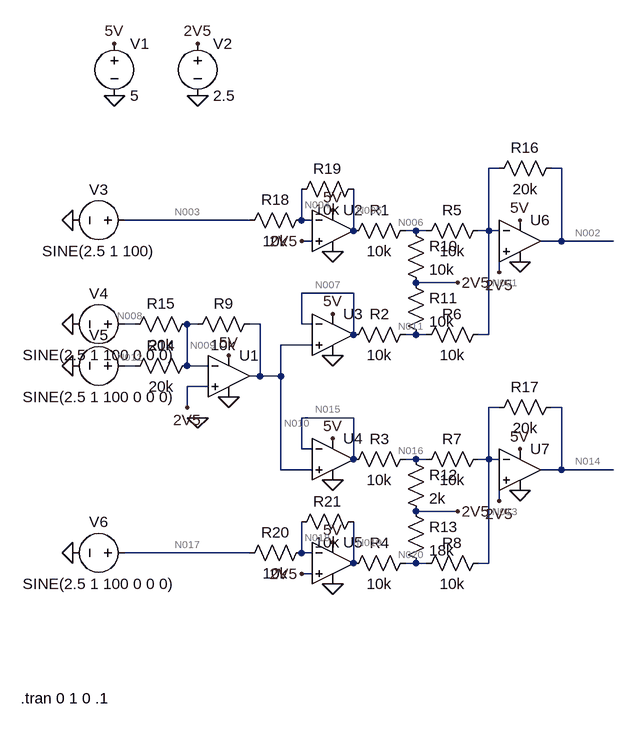
[diagram p0: schematic crossfader.asc]
crossfader.asc, the LTspice schematic file:
Version 4
SHEET 1 1012 832
WIRE 832 0 816 0
WIRE 928 0 912 0
WIRE 448 80 256 80
WIRE 528 80 528 32
WIRE 544 80 528 80
WIRE 608 96 608 32
WIRE 704 96 688 96
WIRE 720 96 704 96
WIRE 816 96 816 0
WIRE 816 96 800 96
WIRE 832 96 816 96
WIRE 544 112 528 112
WIRE 928 112 928 0
WIRE 928 112 896 112
WIRE 1008 112 928 112
WIRE 832 160 832 128
WIRE 768 176 704 176
WIRE 608 192 528 192
WIRE 272 240 256 240
WIRE 368 240 352 240
WIRE 464 240 448 240
WIRE 528 240 528 192
WIRE 544 240 528 240
WIRE 608 256 608 192
WIRE 704 256 688 256
WIRE 720 256 704 256
WIRE 816 256 816 96
WIRE 816 256 800 256
WIRE 544 272 496 272
WIRE 272 304 256 304
WIRE 352 304 352 240
WIRE 384 304 352 304
WIRE 464 320 464 240
WIRE 464 320 448 320
WIRE 496 320 496 272
WIRE 496 320 464 320
WIRE 384 336 352 336
WIRE 352 368 352 336
WIRE 832 368 816 368
WIRE 928 368 912 368
WIRE 608 384 528 384
WIRE 528 432 528 384
WIRE 544 432 528 432
WIRE 608 448 608 384
WIRE 704 448 688 448
WIRE 720 448 704 448
WIRE 816 448 816 368
WIRE 816 448 800 448
WIRE 832 448 816 448
WIRE 496 464 496 320
WIRE 544 464 496 464
WIRE 928 464 928 368
WIRE 928 464 896 464
WIRE 1008 464 928 464
WIRE 832 512 832 480
WIRE 768 528 704 528
WIRE 448 592 256 592
WIRE 528 592 528 544
WIRE 544 592 528 592
WIRE 608 608 608 544
WIRE 704 608 688 608
WIRE 720 608 704 608
WIRE 816 608 816 448
WIRE 816 608 800 608
WIRE 544 624 528 624
FLAG 240 -112 0
FLAG 240 -192 5V
FLAG 416 288 5V
FLAG 416 352 0
FLAG 368 -112 0
FLAG 368 -192 2V5
FLAG 352 368 2V5
FLAG 576 64 5V
FLAG 576 128 0
FLAG 576 224 5V
FLAG 576 288 0
FLAG 576 416 5V
FLAG 576 480 0
FLAG 576 576 5V
FLAG 576 640 0
FLAG 864 80 5V
FLAG 864 144 0
FLAG 864 432 5V
FLAG 864 496 0
FLAG 832 160 2V5
FLAG 832 512 2V5
FLAG 768 176 2V5
FLAG 768 528 2V5
FLAG 176 80 0
FLAG 176 240 0
FLAG 176 304 0
FLAG 176 592 0
FLAG 368 384 0
FLAG 528 112 2V5
FLAG 528 624 2V5
SYMBOL OpAmps/UniversalOpAmp 416 320 R0
SYMATTR InstName U1
SYMBOL Voltage 240 -208 R0
SYMATTR InstName V1
SYMATTR Value 5
SYMBOL Voltage 368 -208 R0
SYMATTR InstName V2
SYMATTR Value 2.5
SYMBOL OpAmps/UniversalOpAmp 576 96 R0
SYMATTR InstName U2
SYMBOL OpAmps/UniversalOpAmp 576 256 R0
SYMATTR InstName U3
SYMBOL OpAmps/UniversalOpAmp 576 448 R0
SYMATTR InstName U4
SYMBOL OpAmps/UniversalOpAmp 576 608 R0
SYMATTR InstName U5
SYMBOL OpAmps/UniversalOpAmp 864 112 R0
SYMATTR InstName U6
SYMBOL OpAmps/UniversalOpAmp 864 464 R0
SYMATTR InstName U7
SYMBOL Res 704 80 R90
WINDOW 0 0 56 VBottom 2
WINDOW 3 32 56 VTop 2
SYMATTR InstName R1
SYMATTR Value 10k
SYMBOL Res 704 240 R90
WINDOW 0 0 56 VBottom 2
WINDOW 3 32 56 VTop 2
SYMATTR InstName R2
SYMATTR Value 10k
SYMBOL Res 704 432 R90
WINDOW 0 0 56 VBottom 2
WINDOW 3 32 56 VTop 2
SYMATTR InstName R3
SYMATTR Value 10k
SYMBOL Res 704 592 R90
WINDOW 0 0 56 VBottom 2
WINDOW 3 32 56 VTop 2
SYMATTR InstName R4
SYMATTR Value 10k
SYMBOL Res 816 80 R90
WINDOW 0 0 56 VBottom 2
WINDOW 3 32 56 VTop 2
SYMATTR InstName R5
SYMATTR Value 10k
SYMBOL Res 816 240 R90
WINDOW 0 0 56 VBottom 2
WINDOW 3 32 56 VTop 2
SYMATTR InstName R6
SYMATTR Value 10k
SYMBOL Res 816 432 R90
WINDOW 0 0 56 VBottom 2
WINDOW 3 32 56 VTop 2
SYMATTR InstName R7
SYMATTR Value 10k
SYMBOL Res 816 592 R90
WINDOW 0 0 56 VBottom 2
WINDOW 3 32 56 VTop 2
SYMATTR InstName R8
SYMATTR Value 10k
SYMBOL Res 464 224 R90
WINDOW 0 0 56 VBottom 2
WINDOW 3 32 56 VTop 2
SYMATTR InstName R9
SYMATTR Value 10k
SYMBOL Res 688 80 R0
SYMATTR InstName R10
SYMATTR Value 10k
SYMBOL Res 688 160 R0
SYMATTR InstName R11
SYMATTR Value 10k
SYMBOL Res 688 432 R0
SYMATTR InstName R12
SYMATTR Value 2k
SYMBOL Res 688 512 R0
SYMATTR InstName R13
SYMATTR Value 18k
SYMBOL Res 368 288 R90
WINDOW 0 0 56 VBottom 2
WINDOW 3 32 56 VTop 2
SYMATTR InstName R14
SYMATTR Value 20k
SYMBOL Res 368 224 R90
WINDOW 0 0 56 VBottom 2
WINDOW 3 32 56 VTop 2
SYMATTR InstName R15
SYMATTR Value 20k
SYMBOL Voltage 272 80 R90
WINDOW 0 -32 56 VBottom 2
WINDOW 3 32 56 VTop 2
SYMATTR InstName V3
SYMATTR Value SINE(2.5 1 100)
SYMBOL Voltage 272 240 R90
WINDOW 0 -32 56 VBottom 2
WINDOW 3 32 56 VTop 2
SYMATTR InstName V4
SYMATTR Value SINE(2.5 1 100 0 0 0)
SYMBOL Voltage 272 304 R90
WINDOW 0 -32 56 VBottom 2
WINDOW 3 32 56 VTop 2
SYMATTR InstName V5
SYMATTR Value SINE(2.5 1 100 0 0 0)
SYMBOL Voltage 272 592 R90
WINDOW 0 -32 56 VBottom 2
WINDOW 3 32 56 VTop 2
SYMATTR InstName V6
SYMATTR Value SINE(2.5 1 100 0 0 0)
SYMBOL Res 928 -16 R90
WINDOW 0 0 56 VBottom 2
WINDOW 3 32 56 VTop 2
SYMATTR InstName R16
SYMATTR Value 20k
SYMBOL Res 928 352 R90
WINDOW 0 0 56 VBottom 2
WINDOW 3 32 56 VTop 2
SYMATTR InstName R17
SYMATTR Value 20k
SYMBOL Res 544 64 R90
WINDOW 0 0 56 VBottom 2
WINDOW 3 32 56 VTop 2
SYMATTR InstName R18
SYMATTR Value 10k
SYMBOL Res 624 16 R90
WINDOW 0 0 56 VBottom 2
WINDOW 3 32 56 VTop 2
SYMATTR InstName R19
SYMATTR Value 10k
SYMBOL Res 544 576 R90
WINDOW 0 0 56 VBottom 2
WINDOW 3 32 56 VTop 2
SYMATTR InstName R20
SYMATTR Value 10k
SYMBOL Res 624 528 R90
WINDOW 0 0 56 VBottom 2
WINDOW 3 32 56 VTop 2
SYMATTR InstName R21
SYMATTR Value 10k
TEXT 96 816 Left 2 !.tran 0 1 0 .1

The netlist it stands for:
* crossfader.asc
XU1 2V5 N009 5V 0 N010 level1 Avol=1Meg GBW=10Meg Vos=0 En=0 Enk=0 In=0 Ink=0 Rin=500Meg  ; pins In+ In- V+ V- OUT
V1 5V 0 5
V2 2V5 0 2.5
XU2 2V5 N004 5V 0 N005 level1 Avol=1Meg GBW=10Meg Vos=0 En=0 Enk=0 In=0 Ink=0 Rin=500Meg  ; pins In+ In- V+ V- OUT
XU3 N010 N007 5V 0 N007 level1 Avol=1Meg GBW=10Meg Vos=0 En=0 Enk=0 In=0 Ink=0 Rin=500Meg  ; pins In+ In- V+ V- OUT
XU4 N010 N015 5V 0 N015 level1 Avol=1Meg GBW=10Meg Vos=0 En=0 Enk=0 In=0 Ink=0 Rin=500Meg  ; pins In+ In- V+ V- OUT
XU5 2V5 N018 5V 0 N019 level1 Avol=1Meg GBW=10Meg Vos=0 En=0 Enk=0 In=0 Ink=0 Rin=500Meg  ; pins In+ In- V+ V- OUT
XU6 2V5 N001 5V 0 N002 level1 Avol=1Meg GBW=10Meg Vos=0 En=0 Enk=0 In=0 Ink=0 Rin=500Meg  ; pins In+ In- V+ V- OUT
XU7 2V5 N013 5V 0 N014 level1 Avol=1Meg GBW=10Meg Vos=0 En=0 Enk=0 In=0 Ink=0 Rin=500Meg  ; pins In+ In- V+ V- OUT
R1 N006 N005 10k
R2 N011 N007 10k
R3 N016 N015 10k
R4 N020 N019 10k
R5 N001 N006 10k
R6 N001 N011 10k
R7 N013 N016 10k
R8 N013 N020 10k
R9 N010 N009 10k
R10 N006 2V5 10k
R11 2V5 N011 10k
R12 N016 2V5 2k
R13 2V5 N020 18k
R14 N009 N012 20k
R15 N009 N008 20k
V3 N003 0 SINE(2.5 1 100)
V4 N008 0 SINE(2.5 1 100 0 0 0)
V5 N012 0 SINE(2.5 1 100 0 0 0)
V6 N017 0 SINE(2.5 1 100 0 0 0)
R16 N002 N001 20k
R17 N014 N013 20k
R18 N004 N003 10k
R19 N005 N004 10k
R20 N018 N017 10k
R21 N019 N018 10k
.tran 0 1 0 .1
.lib UniversalOpAmp1.lib
.backanno
.end

* Results of the author's LTspice run, read from the files saved beside the schematic
* Operating Point, zero values left out:
*   V(n009) = 2.5 V
*   V(2v5) = 2.5 V
*   V(n010) = 2.5 V
*   V(5v) = 5 V
*   V(n004) = 2.5 V
*   V(n005) = 2.5 V
*   V(n007) = 2.5 V
*   V(n015) = 2.5 V
*   V(n018) = 2.5 V
*   V(n019) = 2.5 V
*   V(n001) = 2.5 V
*   V(n002) = 2.5 V
*   V(n013) = 2.5 V
*   V(n014) = 2.5 V
*   V(n006) = 2.5 V
*   V(n011) = 2.5 V
*   V(n016) = 2.5 V
*   V(n020) = 2.5 V
*   V(n012) = 2.5 V
*   V(n008) = 2.5 V
*   V(n003) = 2.5 V
*   V(n017) = 2.5 V
*   I(R1) = 250 pA
*   I(R2) = 416.7 pA
*   I(R3) = 607.1 pA
*   I(R4) = 206.5 pA
*   I(R6) = 83.33 pA
*   I(R7) = -107.1 pA
*   I(R8) = 43.47 pA
*   I(R9) = -250 pA
*   I(R10) = -250 pA
*   I(R11) = 333.3 pA
*   I(R12) = -714.3 pA
*   I(R13) = 163 pA
*   I(R14) = -125 pA
*   I(R15) = -125 pA
*   I(R16) = 83.33 pA
*   I(R17) = -63.7 pA
*   I(R18) = -250 pA
*   I(R19) = -250 pA
*   I(R20) = -250 pA
*   I(R21) = -250 pA
*   I(V1) = -35 nA
*   I(V2) = -1.461 nA
*   I(V3) = -250 pA
*   I(V4) = -125 pA
*   I(V5) = -125 pA
*   I(V6) = -250 pA
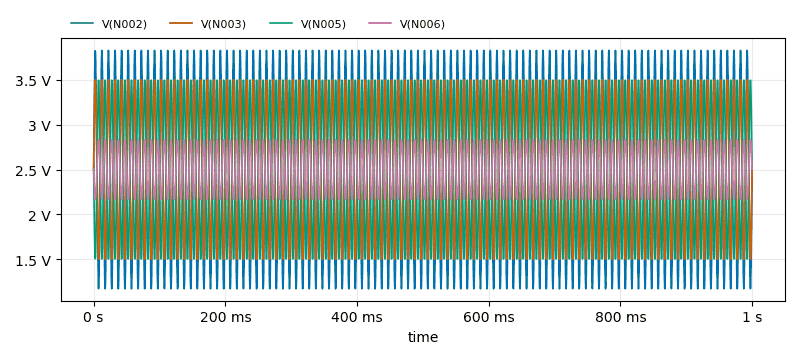
[diagram p1: Transient Analysis of crossfader.asc, plotted from the saved traces]
* Transient Analysis, 1 run:
*   V(N002): min 1.171 V, max 3.829 V, average 2.5 V, rms 2.671 V, last 2.5 V
*   V(N003): min 1.5 V, max 3.5 V, average 2.5 V, rms 2.601 V, last 2.5 V
*   V(N005): min 1.503 V, max 3.497 V, average 2.5 V, rms 2.598 V, last 2.5 V
*   V(N006): min 2.168 V, max 2.832 V, average 2.5 V, rms 2.511 V, last 2.5 V